# EAGLE design 3dr lcd (EAGLE 6.2)
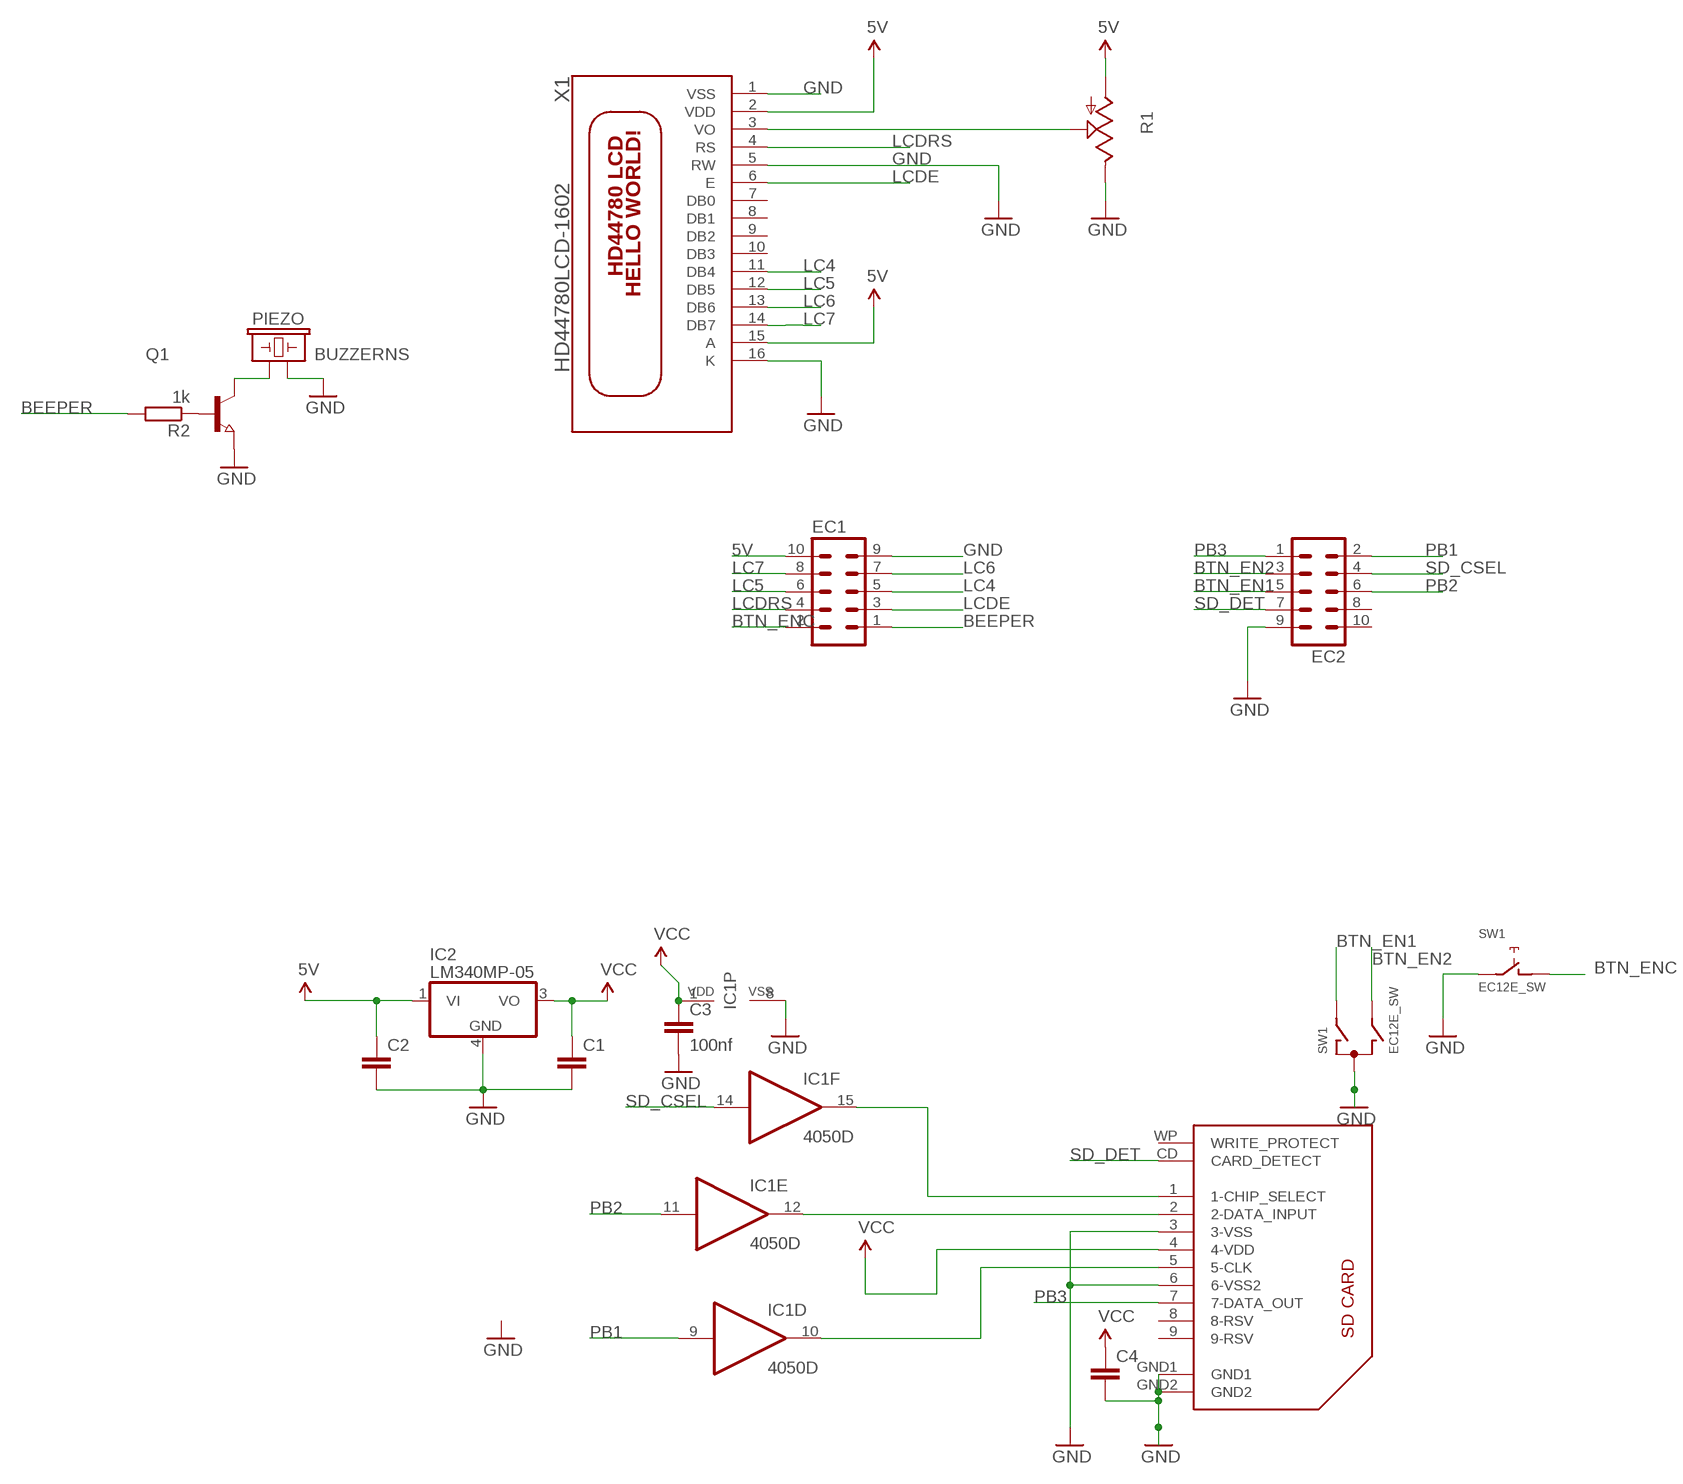
[diagram p0: schematic, sheet 1]

## Parts
C1  C-EUC1206K  [C1206K]
C2  C-EUC1206K  [C1206K]
C3  100nf  C-EUC1206K  [C1206K]
C4  C-EUC1206K  [C1206K]
EC1  ML10  [ML10]
EC2  ML10  [ML10]
IC1  4050D  [SO16]
IC2  LM340MP-05  [SOT223]
PIEZO  BUZZERNS  [BUZZER-12MM-NS]
Q1  NPN-TRANSISTOR_SOT23  [SOT23]
R1  TRIM_US-3364W  [3364W]
R2  1k  R-EU_R0805  [R0805]
SW1  EC12E_SW  [ALPS_EC12E_SW]
U$2  SDCARD  [3M-SDCARD]
X1  HD44780LCD-1602  [LCD1602]

## Nets
5V: EC1.10 R1.1(A) X1.2(VDD) X1.15(A)
BEEPER: EC1.1 R2.2
BTN_EN1: EC2.5 SW1.A
BTN_EN2: EC2.3 SW1.B
BTN_ENC: EC1.2 SW1.D
D31: PIEZO.+ Q1.3(C)
GND [gnd]: C1.2 C2.2 C3.2 C4.2 EC1.9 EC2.9 IC1.8(P:VSS) IC2.4(GND) PIEZO.- Q1.2(E) R1.3(E) SW1.C SW1.E U$2.3(3-VSS) U$2.6(6-VSS2) U$2.GND1 U$2.GND2 X1.1(VSS) X1.5(RW) X1.16(K)
LC4: EC1.5 X1.11(DB4)
LC5: EC1.6 X1.12(DB5)
LC6: EC1.7 X1.13(DB6)
LC7: EC1.8 X1.14(DB7)
LCDE: EC1.3 X1.6(E)
LCDRS: EC1.4 X1.4(RS)
N$1: Q1.1(B) R2.1
N$4: R1.2(S) X1.3(VO)
N$7: C2.1 IC2.1(VI)
N$9: IC1.15(F:O) U$2.1(1-CHIP_SELECT)
N$10: IC1.12(E:O) U$2.2(2-DATA_INPUT)
N$11: IC1.10(D:O) U$2.5(5-CLK)
PB1: EC2.2 IC1.9(D:I)
PB2: EC2.6 IC1.11(E:I)
PB3: EC2.1 U$2.7(7-DATA_OUT)
SD_CSEL: EC2.4 IC1.14(F:I)
SD_DET: EC2.7 U$2.CD(CARD_DETECT)
VCC: C1.1 C3.1 C4.1 IC1.1(P:VDD) IC2.3(VO) U$2.4(4-VDD)
Unconnected: EC2.8 EC2.10 IC1.2(A:O) IC1.3(A:I) IC1.4(B:O) IC1.5(B:I) IC1.6(C:O) IC1.7(C:I) SW1.GND1(G) SW1.GND2(G) U$2.8(8-RSV) U$2.9(9-RSV) U$2.WP(WRITE_PROTECT) X1.7(DB0) X1.8(DB1) X1.9(DB2) X1.10(DB3)

## Library data of the parts
C1-C4 = rcl:C-EU: CAPACITOR, European symbol
EC1 EC2 = con-harting-ml:ML10: HARTING; OC_FARNELL: unknown; OC_NEWARK: unknown
IC1 = 40xx:4050: Hex non-inverting BUFFER
IC2 = linear:LM340?-*: Positive VOLTAGE REGULATOR Source: http://cache.national.com/ds/LM/LM340.pdf
PIEZO = SparkFun:BUZZER: Buzzer 12mm Spark Fun Electronics SKU : Comp-Buzzer
Q1 = semicon-smd-ipc:NPN-TRANSISTOR_: NPN TRANSISTOR
R1 = reprap:TRIM_US-: POTENTIOMETER
R2 = resistor:R-EU_: RESISTOR, European symbol
SW1 = switch-alps:EC12E_SW: ALPS rotary Encoder EC12E series with switch; MPN: EC12E2424407; OC_FARNELL: 1520813; OC_NEWARK: 74M1068
U$2 = reprap:SDCARD
X1 = adafrui 2 :HD44780LCD: HD44780 LCD Standard character type LCDs, available in sizes from 8x1 to 40x4!

## Net classes
1 power: width 0.61 mm, drill 0.61 mm, clearance 0.254 mm
2 gnd: width 0.305 mm, drill 0.711 mm, clearance 0.203 mm
3 usbvcc: width 0.508 mm, drill 0.61 mm, clearance 0.254 mm

## Board
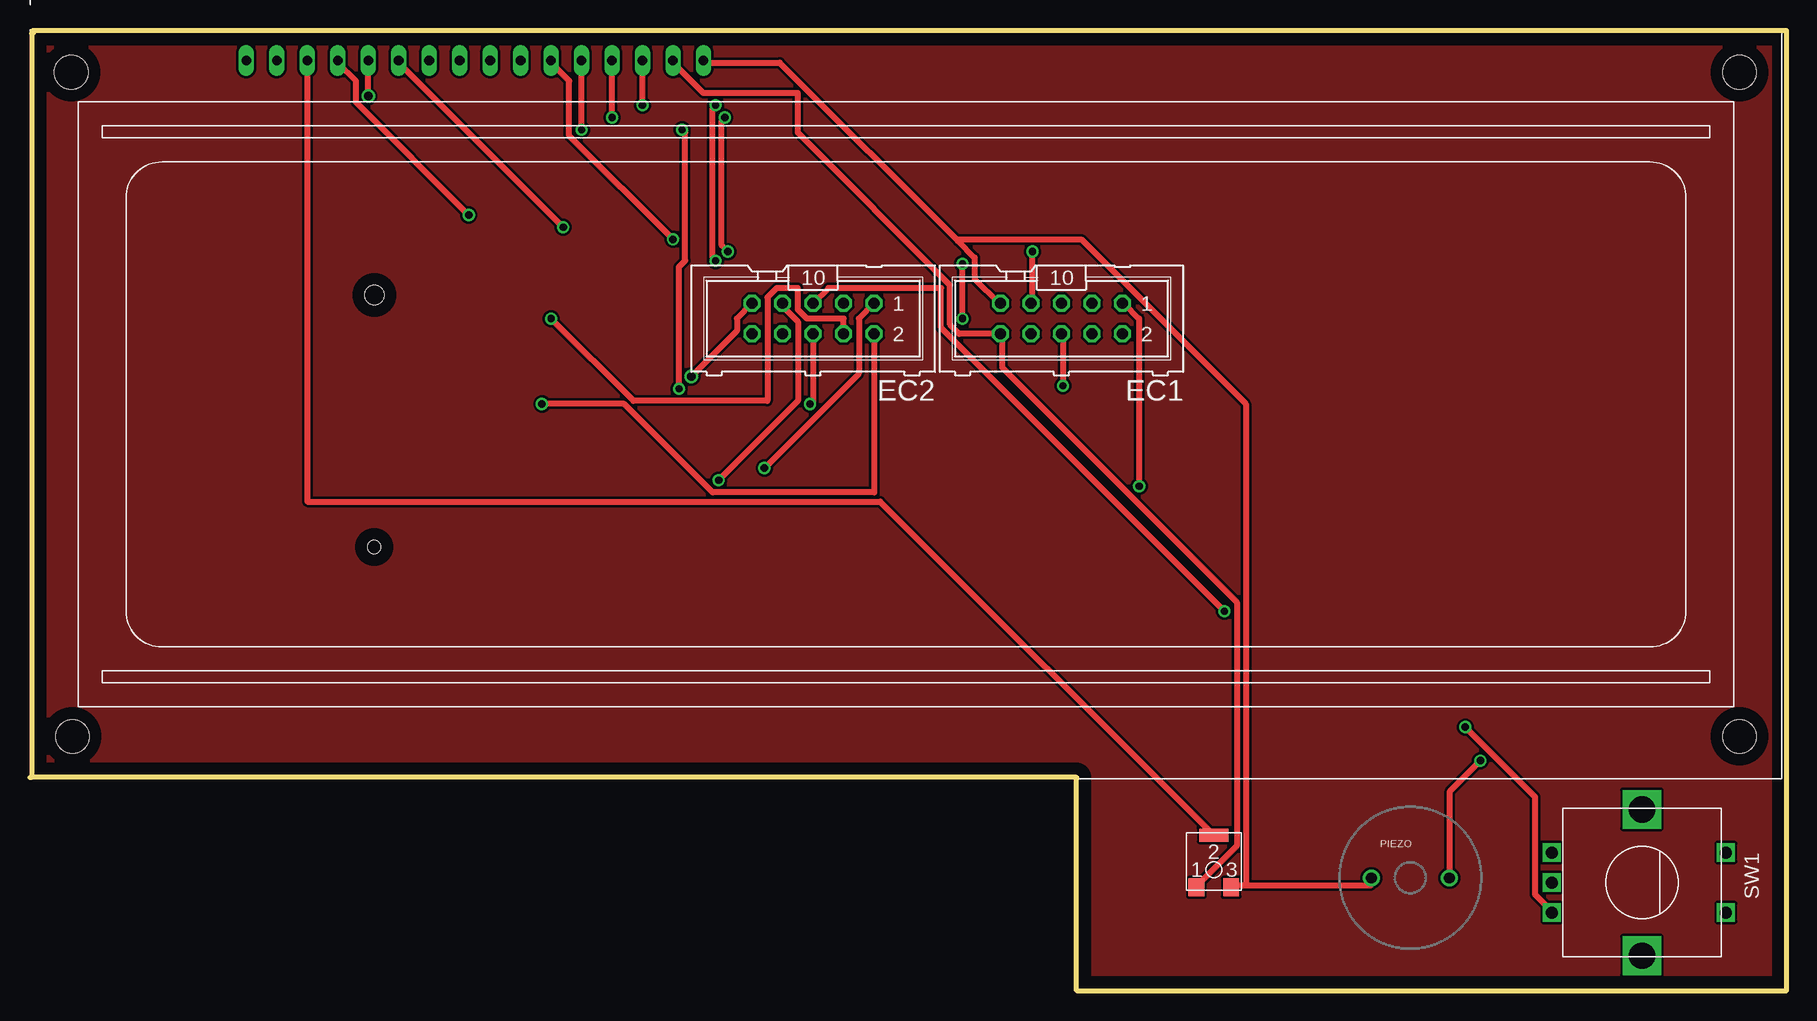
[diagram p1: board, top side]
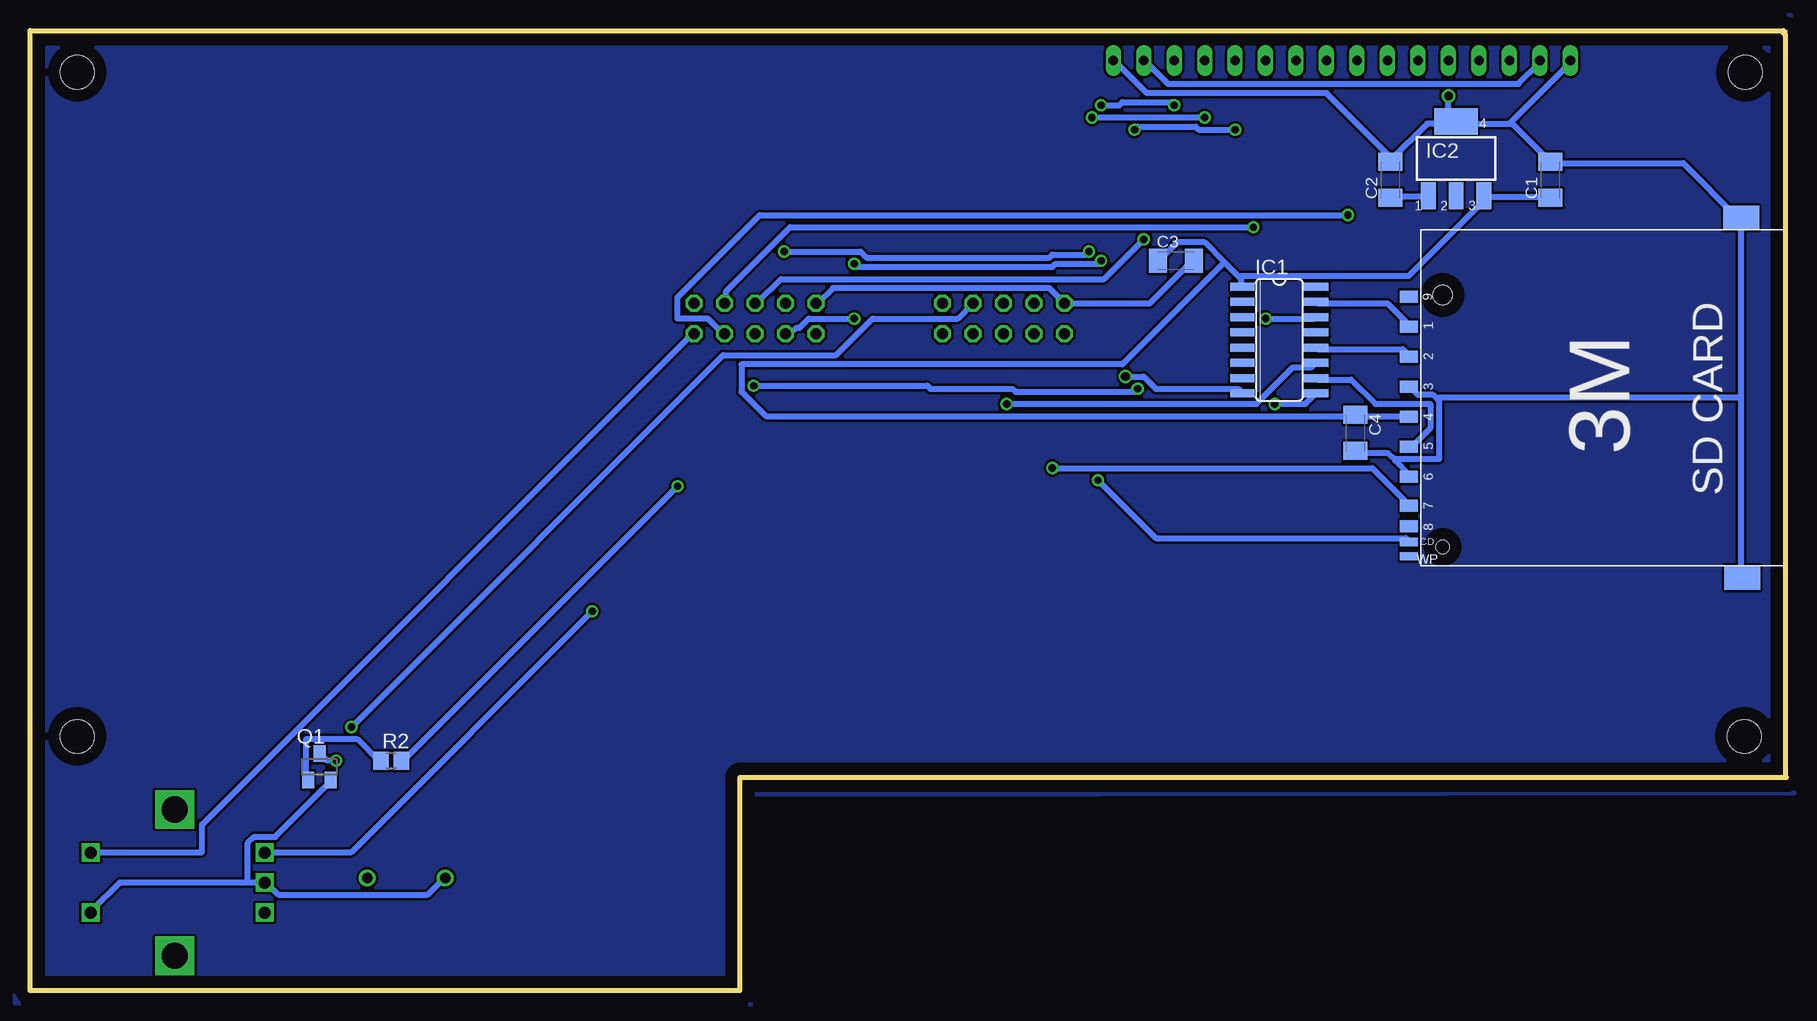
[diagram p2: board, bottom side, seen from below]

Size 146.43 x 80.06 mm. Coordinates in mm from the lower left corner, seen from the top.
Outline: 146.28,0.13 146.28,80.06 0,80.06 0,17.78 0.13,17.78
Outline: 0.13,17.78 87.25,17.78 87.25,0 146.43,0 146.43,80.01 0.25,80.01 0.25,79.76 0.13,79.76 0.13,17.78
Copper layers (1*16): Top 0.035mm / dielectric 1.5mm / Bottom 0.035mm
Design rules: minimum track width 20mil, minimum drill 24mil, track to track 8mil, track to pad 8mil, pad to pad 8mil, via to via 8mil, smd to smd 8mil, copper to edge 40mil, drill to drill 8mil, minimum pad ring 10mil, minimum via ring 8mil, stop-mask expansion 4mil, vias tented up to drill 0mil, thermal gap 10mil

### Footprints (pad centres in the part's own frame; a part is rotated, then mirrored left to right if it is on the bottom)
C1206K = smd 1.5 x 2: 1 -1.5,0; 2 1.5,0
ML10 = drill 0.914 octagon: 1 -5.08,-1.27; 2 -5.08,1.27; 3 -2.54,-1.27; 4 -2.54,1.27; 5 0,-1.27; 6 0,1.27; 7 2.54,-1.27; 8 2.54,1.27; 9 5.08,-1.27; 10 5.08,1.27
SO16 = smd 0.66 x 2.032: 1 -4.445,-3.073; 2 -3.175,-3.073; 3 -1.905,-3.073; 4 -0.635,-3.073; 5 0.635,-3.073; 6 1.905,-3.073; 7 3.175,-3.073; 8 4.445,-3.073; 9 4.445,3.073; 10 3.175,3.073; 11 1.905,3.073; 12 0.635,3.073; 13 -0.635,3.073; 14 -1.905,3.073; 15 -3.175,3.073; 16 -4.445,3.073
SOT223 = smd 1.219 x 2.235: 1 -2.311,-3.099; 2 0,-3.099; 3 2.311,-3.099 | smd 3.6 x 2.2: 4 0,3.099
BUZZER-12MM-NS = drill 0.9: + 3.25,0; - -3.25,0
SOT23 = smd 1 x 1.4: 1 -0.95,-1.1; 2 0.95,-1.1; 3 0,1.1
3364W = smd 1.3 x 1.5: 1 -1.45,-2.05; 3 1.45,-2.05 | smd 2.4 x 1.1: 2 0,2.3
R0805 = smd 1.3 x 1.5: 1 -0.85,0; 2 0.85,0
ALPS_EC12E_SW = drill 1 square: A -2.5,-7.5; B 2.5,-7.5; C 0,-7.5; D -2.5,7; E 2.5,7 | drill 2.2 square: GND1 -6.1,0; GND2 6.1,0
3M-SDCARD = smd 1 x 1.5: 1 5.93,16.5; 2 3.43,16.5; 3 0.93,16.5; 4 -1.57,16.5; 5 -4.07,16.5; 6 -6.57,16.5; 7 -9,16.5; 8 -10.7,16.5; 9 8.43,16.5 | smd 0.7 x 1.5: CD -12,16.5; WP -13.2,16.5 | smd 2 x 3: GND1 -15,-11.3; GND2 15,-11.2 | hole 1.1: -12.427,13.705 | hole 1.6: 8.567,13.708
LCD1602 = drill 0.8 long: 1 18.033,59.876; 2 20.573,59.876; 3 23.113,59.876; 4 25.653,59.876; 5 28.193,59.876; 6 30.733,59.876; 7 33.273,59.876; 8 35.813,59.876; 9 38.353,59.876; 10 40.893,59.876; 11 43.433,59.876; 12 45.973,59.876; 13 48.513,59.876; 14 51.053,59.876; 15 53.593,59.876; 16 56.133,59.876 | hole 2.8: 3.54,3.54; 3.44,58.876; 142.5,58.876; 142.5,3.54

### Placement (x,y rotation side)
C1  19.68,67.56 90 bottom
C2  33.02,67.56 90 bottom
C3  50.93,60.83 0 bottom
C4  35.94,46.48 270 bottom
EC1  85.98,56.01 180 top
EC2  65.28,56.01 180 top
IC1  42.29,54.23 270 bottom
IC2  27.56,69.34 0 bottom
PIEZO  115.06,9.4 0 top
Q1  122.3,18.67 0 bottom
R1  98.68,10.67 0 top
R2  116.33,19.18 0 bottom
SW1  134.37,9.02 270 top
U$2  14.99,49.4 90 bottom
X1  0,17.65 0 top

### Tracks (layer width: path | path; a pad name or v marks a point on that pad's centre or on a via)
5V
  Top 0.508: R1.1 97.28,8.76 100.58,12.07 100.58,32.39 81.03,51.94 81.03,54.74 EC1.10 77.47,54.74 76.71,55.5 76.71,58.8 64.01,71.5 64.01,74.8 56.13,74.8 53.59,77.34 X1.15
  Bottom 0.508: X1.2 20.57,77.34 22.35,75.56 51.56,75.56 53.34,77.34 X1.15
BEEPER  (via drill 0.61)
  Top 0.508: v92.46,42.04 92.46,56.01 91.19,57.28 EC1.1
  Bottom 0.508: v92.46,42.04 115.32,19.18 R2.2
BTN_EN1  (via drill 0.61)
  Top 0.508: EC2.5 66.55,58.55 75.95,58.55 75.95,55.25 v99.57,31.62
  Bottom 0.508: v99.57,31.62 119.63,11.56 126.75,11.56 SW1.A
BTN_EN2  (via drill 0.61)
  Top 0.508: v119.63,21.97 125.48,16.13 125.48,8 126.75,6.73 SW1.B
  Bottom 0.508: EC2.3 69.09,56.01 76.2,56.01 79.25,52.96 88.65,52.96 v119.63,21.97
BTN_ENC
  Bottom 0.508: EC1.2 91.19,54.74 132.08,13.84 132.08,11.56 141.22,11.56 SW1.D
D31  (via drill 0.61)
  Top 0.508: v120.9,19.18 118.36,16.64 118.36,9.53 PIEZO.+
  Bottom 0.508: v120.9,19.18 121.67,19.18 122.17,19.68 Q1.3
GND  (via drill 0.71)
  Top 0.508: 101.35,8.76 111.76,8.76 111.76,9.27 PIEZO.- | 101.35,8.76 100.33,8.76 R1.3 | v55.12,51.18 58.93,54.99 58.93,56.01 EC2.9 | v28.19,74.55 28.19,77.34 X1.5 | 77.34,62.48 62.48,77.34 56.13,77.34 X1.16 | 77.34,62.48 78.74,61.09 78.74,59.31 80.77,57.28 EC1.9 | 101.35,8.76 101.35,48.9 87.63,62.61 77.47,62.61 77.34,62.48
  Bottom 0.508: 32.64,44.2 33.27,44.83 35.81,44.83 C4.2 | 32.64,44.2 31.5,43.05 U$2.6 | 29.08,49.28 28.96,49.15 28.96,44.32 32.51,44.32 32.64,44.2 | 29.08,49.28 29.46,49.66 30.73,49.66 31.24,50.16 U$2.3 | 3.81,49.4 3.81,64.39 U$2.GND2 4.06,64.39 8.64,68.96 19.56,68.96 C1.2 19.81,69.21 22.86,72.26 23.11,72.26 | 3.81,49.4 3.81,34.42 U$2.GND1 | 3.81,49.4 28.96,49.4 29.08,49.28 | 128.27,9.02 128.27,12.32 127.76,12.83 125.98,12.83 121.41,17.4 Q1.2 | 128.27,9.02 SW1.C 126.75,9.02 125.73,8 113.28,8 112.01,9.27 PIEZO.- | 128.27,9.02 138.94,9.02 141.22,6.73 SW1.E | C3.2 49.53,60.83 53.09,57.28 EC2.9 61.47,58.55 79.5,58.55 80.77,57.28 EC1.9 | v55.12,51.18 53.59,51.18 52.58,50.16 45.72,50.16 45.47,49.91 IC1.8 | 23.11,72.26 27.43,72.26 IC2.4 | 28.19,72.26 27.69,72.26 IC2.4 | 28.19,72.26 29.97,72.26 33.02,69.21 C2.2 33.02,69.47 38.35,74.8 53.34,74.8 55.88,77.34 X1.16 | 23.11,72.26 18.03,77.34 X1.1 | 28.19,72.26 v28.19,74.55 | 28.19,72.26 IC2.4
LC4  (via drill 0.61)
  Top 0.508: v53.59,62.61 44.96,71.25 44.96,75.82 43.43,77.34 X1.11
  Bottom 0.508: v53.59,62.61 56.9,59.31 83.82,59.31 85.85,57.28 EC1.5
LC5  (via drill 0.61)
  Top 0.508: v45.97,71.75 45.97,77.34 X1.12 | v54.36,71.75 54.61,71.5 54.61,60.83 54.1,60.33 v54.1,50.16 | v86.11,50.42 86.11,54.74 EC1.6
  Bottom 0.508: v45.97,71.75 49.02,71.75 49.28,72.01 54.1,72.01 v54.36,71.75 | v54.1,50.16 54.36,49.91 64.26,49.91 64.52,50.16 71.37,50.16 71.63,50.42 v86.11,50.42
LC6  (via drill 0.61)
  Top 0.508: v48.51,72.77 48.51,77.34 X1.13 | v57.91,72.77 57.66,72.52 57.66,62.1 v58.17,61.6 | v83.57,61.6 83.57,57.28 EC1.7
  Bottom 0.508: v57.91,72.77 v48.51,72.77 | v58.17,61.6 58.42,61.34 61.21,61.34 61.47,61.09 76.71,61.09 77.22,61.6 v83.57,61.6
LC7  (via drill 0.61)
  Top 0.508: v51.05,73.79 51.05,77.34 X1.14 | v57.15,73.79 56.9,73.53 56.9,61.09 v57.15,60.83 | v77.72,56.01 v77.72,60.58
  Bottom 0.508: v51.05,73.79 51.31,74.04 55.37,74.04 55.63,73.79 v57.15,73.79 | v57.15,60.83 57.4,60.58 60.96,60.58 61.21,60.33 77.47,60.33 v77.72,60.58 | v77.72,56.01 81.53,56.01 82.3,55.25 82.55,55.25 83.06,54.74 EC1.8
LCDE  (via drill 0.61)
  Top 0.508: v44.45,63.63 30.73,77.34 X1.6
  Bottom 0.508: v44.45,63.63 83.06,63.63 88.39,58.29 88.39,57.28 EC1.3
LCDRS  (via drill 0.61)
  Top 0.508: v36.58,64.64 27.18,74.04 27.18,75.82 25.65,77.34 X1.4
  Bottom 0.508: v36.58,64.64 85.6,64.64 92.46,57.79 92.46,56.01 89.92,56.01 88.65,54.74 EC1.4
N$1
  Bottom 0.508: Q1.1 123.44,17.65 123.44,20.95 119.13,20.95 117.35,19.18 R2.1
N$2
  pour Bottom: -0.38,81.28 147.19,81.03 147.19,72.9 147.7,-1.02 86.36,-1.14 86.23,16.38 -0.64,16.51
N$3
  pour Top: 0.38,80.14 146.56,80.14 146.56,78.99 146.43,78.99 146.43,0 87.38,0 87.38,0.13 87.25,0.13 87.25,17.65 0.13,17.65 0.13,17.78 0.25,17.78 0.25,80.14
N$4
  Top 0.508: R1.2 98.55,13.08 70.87,40.77 23.11,40.77 23.11,77.34 X1.3
N$7
  Bottom 0.508: C2.1 33.02,66.17 29.97,66.17 IC2.1
N$9
  Bottom 0.508: U$2.1 31.5,55.5 33.27,57.28 39.12,57.28 IC1.15
N$10
  Bottom 0.508: U$2.2 31.5,52.96 32,53.47 39.12,53.47 IC1.12
N$11
  Bottom 0.508: U$2.5 31.24,45.34 29.72,46.86 29.72,48.9 34.29,48.9 36.32,50.93 39.12,50.93 IC1.10
PB1  (via drill 0.61)
  Top 0.508: v42.67,48.9 49.53,48.9 56.9,41.53 70.36,41.53 EC2.2
  Bottom 0.508: v42.67,48.9 40.13,48.9 39.37,49.66 IC1.9
PB2  (via drill 0.61)
  Top 0.508: v65.02,48.9 65.28,49.15 EC2.6
  Bottom 0.508: v65.02,48.9 44.2,48.9 41.15,51.94 39.62,51.94 39.37,52.2 IC1.11
PB3  (via drill 0.61)
  Top 0.508: v61.21,43.56 69.09,51.44 69.09,56.01 EC2.1
  Bottom 0.508: v61.21,43.56 34.54,43.56 31.5,40.51 U$2.7
SD_CSEL  (via drill 0.61)
  Top 0.508: v43.43,56.01 50.29,49.15 61.47,49.15 61.47,57.79 62.23,58.55 64.01,58.55 64.01,56.77 64.77,56.01 67.82,56.01 EC2.4
  Bottom 0.508: v43.43,56.01 39.37,56.01 IC1.14
SD_DET  (via drill 0.61)
  Top 0.508: v57.4,42.55 64.01,49.15 64.01,55.75 62.74,57.02 EC2.7
  Bottom 0.508: v57.4,42.55 52.58,37.72 31.75,37.72 31.5,37.47 U$2.CD
VCC
  Bottom 0.508: C1.1 19.81,66.17 25.15,66.17 IC2.3 25.15,65.91 31.5,59.56 45.47,59.56 45.59,59.44 | U$2.4 31.5,47.88 35.81,47.88 C4.1 36.07,47.88 85.09,47.88 87.12,49.91 87.12,52.2 55.37,52.2 46.86,60.71 | 45.59,59.44 45.47,59.31 45.47,58.8 IC1.1 | 45.59,59.44 46.86,60.71 | 46.86,60.71 48.51,62.36 50.8,62.36 52.32,60.83 C3.1